# EAGLE schematic Utility VCO (EAGLE 6.0)
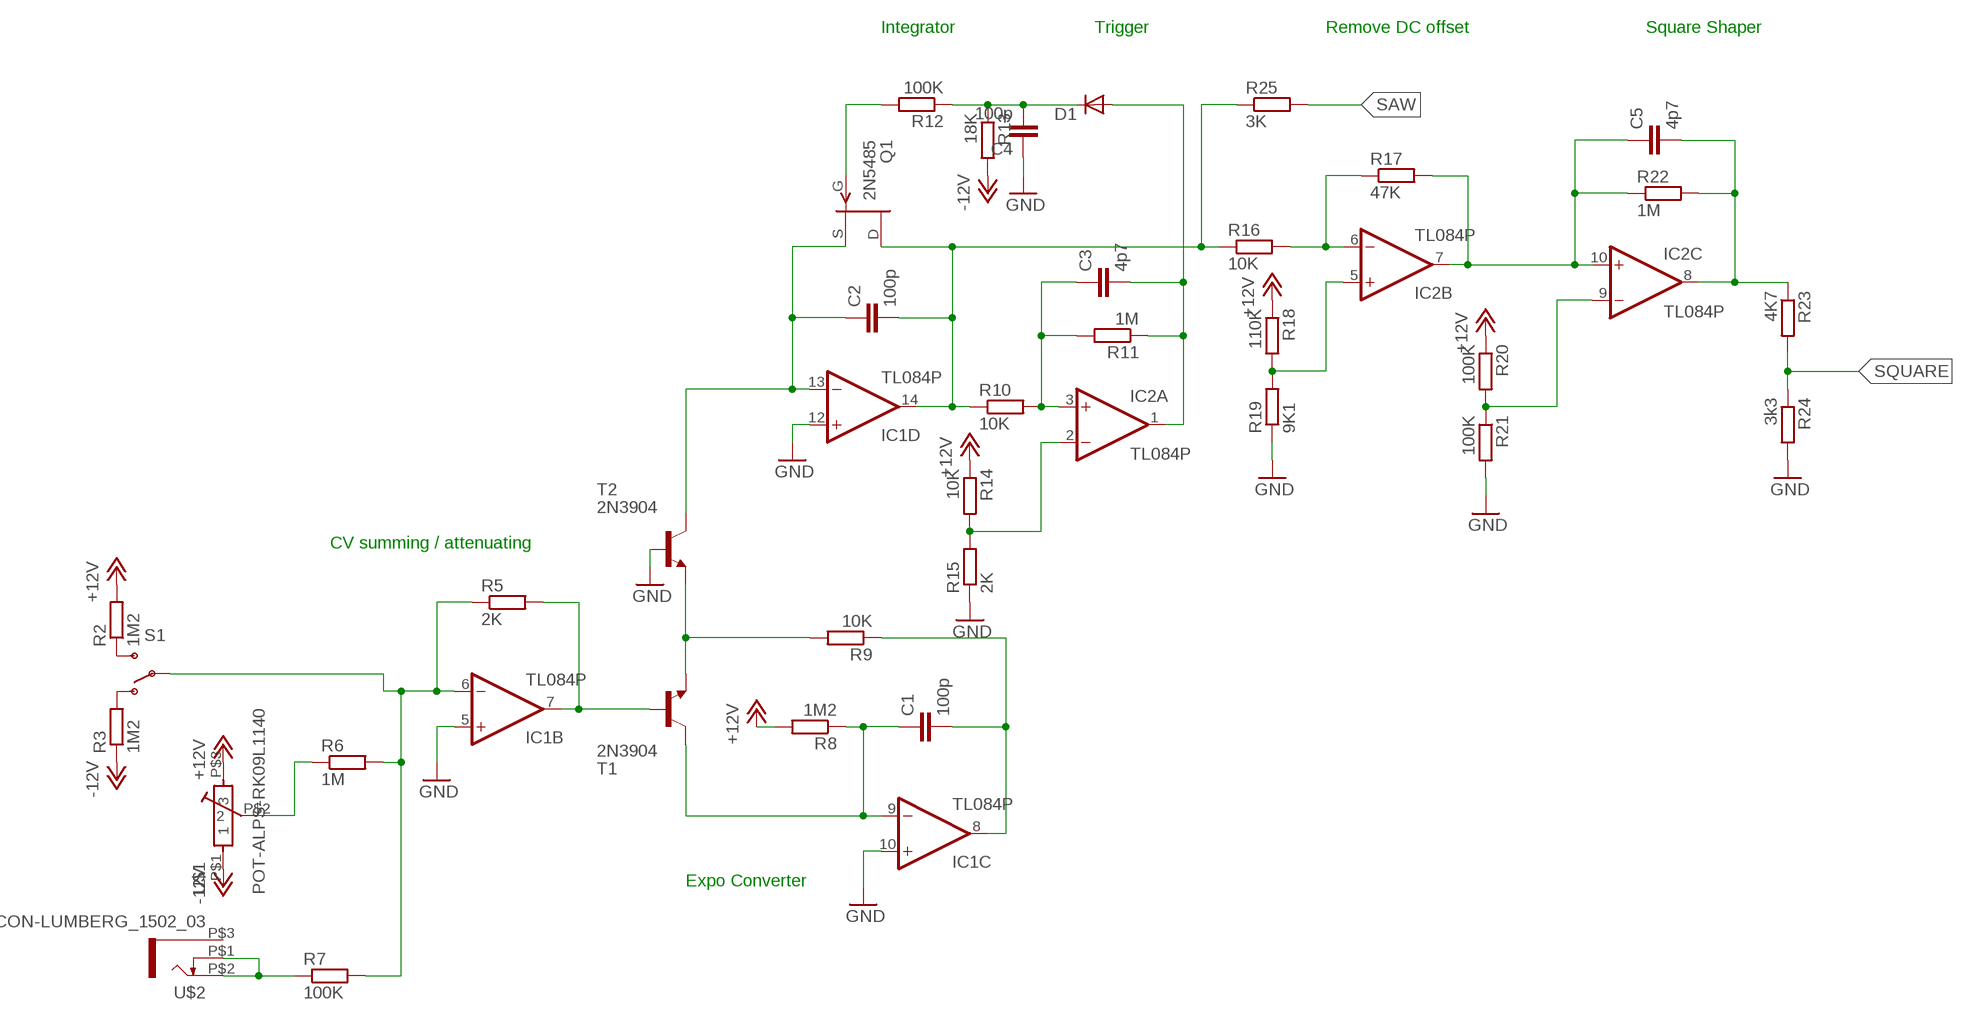
[diagram p0: schematic, sheet 1]

## Parts
C1  100p  C-EU050-024X044  [C050-024X044]
C2  100p  C-EU050-024X044  [C050-024X044]
C3  4p7  C-EU050-024X044  [C050-024X044]
C4  100p  C-EU050-024X044  [C050-024X044]
C5  4p7  C-EU050-024X044  [C050-024X044]
D1  DIODE1N4148  [DIODE-1N4148]
IC1  TL084P  [DIL14]
IC2  TL084P  [DIL14]
Q1  2N5485  [TO92-]
R2  1M2  R-EU_0204/7  [0204/7]
R3  1M2  R-EU_0204/7  [0204/7]
R5  2K  R-EU_0204/7  [0204/7]
R6  1M  R-EU_0204/7  [0204/7]
R7  100K  R-EU_0204/7  [0204/7]
R8  1M2  R-EU_0204/7  [0204/7]
R9  10K  R-EU_0204/7  [0204/7]
R10  10K  R-EU_0204/7  [0204/7]
R11  1M  R-EU_0204/7  [0204/7]
R12  100K  R-EU_0204/7  [0204/7]
R13  18K  R-EU_0204/7  [0204/7]
R14  10K  R-EU_0204/7  [0204/7]
R15  2K  R-EU_0204/7  [0204/7]
R16  10K  R-EU_0204/7  [0204/7]
R17  47K  R-EU_0204/7  [0204/7]
R18  110K  R-EU_0204/7  [0204/7]
R19  9K1  R-EU_0204/7  [0204/7]
R20  100K  R-EU_0204/7  [0204/7]
R21  100K  R-EU_0204/7  [0204/7]
R22  1M  R-EU_0204/7  [0204/7]
R23  4K7  R-EU_0204/7  [0204/7]
R24  3k3  R-EU_0204/7  [0204/7]
R25  3K  R-EU_0204/7  [0204/7]
S1  SWITCH-SPST  [SWITCH-SPDT-SALECOM-T8014]
T1  2N3904  [TO92]
T2  2N3904  [TO92]
U$1  POT-ALPS-RK09L1140  [POT-ALPS-RK09L1140]
U$2  CON-LUMBERG_1502_03  [CON-LUMBERG_1502_03]

## Nets
+12V: R2.2 R8.2 R14.1 R18.1 R20.1 U$1.P$3
-12V: R3.1 R13.2 U$1.P$1
GND: C4.1 IC1.5(B:+IN) IC1.10(C:+IN) IC1.12(D:+IN) R15.1 R19.1 R21.2 R24.2 T2.2(B)
N$1: IC1.6(B:-IN) R5.1 R6.2 R7.2 S1.2(P)
N$2: R6.1 U$1.P$2
N$3: R2.1 S1.3(S)
N$4: R3.2 S1.1(O)
N$6: IC1.7(B:OUT) R5.2 T1.2(B)
N$8: R7.1 U$2.P$1 U$2.P$2
N$9: R9.2 T1.3(E) T2.3(E)
N$10: C1.1 IC1.9(C:-IN) R8.1 T1.1(C)
N$11: C1.2 IC1.8(C:OUT) R9.1
N$12: C2.1 IC1.13(D:-IN) Q1.2(S) T2.1(C)
N$13: C2.2 IC1.14(D:OUT) Q1.3(D) R10.1 R16.1 R25.1
N$14: C3.1 IC2.3(A:+IN) R10.2 R11.2
N$15: C3.2 D1.A IC2.1(A:OUT) R11.1
N$16: Q1.1(G) R12.2
N$17: C4.2 D1.C R12.1 R13.1
N$18: IC2.2(A:-IN) R14.2 R15.2
N$19: IC2.6(B:-IN) R16.2 R17.1
N$20: C5.1 IC2.7(B:OUT) IC2.10(C:+IN) R17.2 R22.1
N$21: IC2.5(B:+IN) R18.2 R19.2
N$23: IC2.9(C:-IN) R20.2 R21.1
N$26: C5.2 IC2.8(C:OUT) R22.2 R23.1
SAW: R25.2
SQUARE: R23.2 R24.1
Unconnected: IC1.1(A:OUT) IC1.2(A:-IN) IC1.3(A:+IN) IC2.12(D:+IN) IC2.13(D:-IN) IC2.14(D:OUT) U$1.P$4 U$1.P$6 U$2.P$3

## Notes on the sheet
- Integrator | Trigger | Remove DC offset | Square Shaper
- CV summing / attenuating
- Expo Converter

## Power pins joined to a net without a drawn wire
V+: IC1.4(P:V+) IC2.4(P:V+)
V-: IC1.11(P:V-) IC2.11(P:V-)

## Library data of the parts
C1-C5 = rcl:C-EU: CAPACITOR, European symbol
D1 = SparkFun:DIODE: Diode These are standard reverse protection diodes and small signal diodes. SMA package can handle up to about 1A. SOD-323 can handle about 200mA. What the SOD-323 package when ordering, there are some mfgs out there that are 5-pin packages.
IC1 IC2 = linear:TL084: OP AMP
Q1 = transistor-fet:?548*: N-Channel JFETs Source: VISHAY 2N5484.pdf Compatible: TO92 2N5245 J304 J305 U310 J308 J309 J310 TO72 2N4416 2N4416A 2N3823 2N4351 3N169 3N170 3N171 MFE3002 TO18 2N3796 2N3797 MFE825 Source: Motorola European Master Guide Pacge 3-59
R2 R3 R5-R25 = rcl:R-EU_: RESISTOR, European symbol
S1 = Rebel:SWITCH-SPST: SPST Switch Simple slide switch. Spark Fun Electronics SKU : COM-00102
T1 T2 = transistor:2N3904: NPN TRANSISTOR
U$1 = Rebel:POT-ALPS-RK09L
U$2 = Rebel:CON-LUMBERG_1502_03